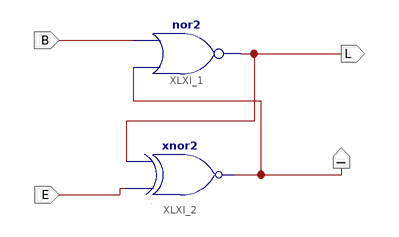
[diagram p0: schematic sheet 1]
// Xilinx ISE schematic lab7_experiment11.sch (spartan3e) as structural Verilog: 2 symbols, 4 ports
module lab7_experiment11 (
  input  B,
  input  E,
  output L,
  output I
);

  nor XLXI_1 (L, I, B);
  xnor XLXI_2 (I, E, L);
endmodule
